# Altium schematic sheet adc.SchDoc
size A4
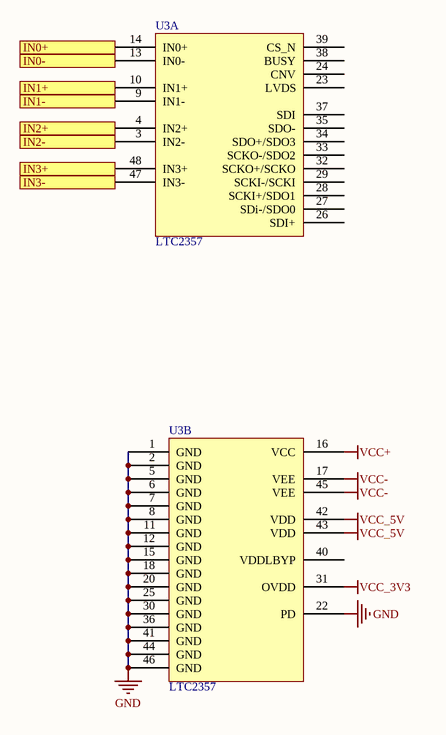
[diagram p0: adc.SchDoc]

## Parts
U3  LTC2357  [LTC2357]  (parts A,B of 2)

## Ports
IN0+ (in), IN0- (in), IN1+ (in), IN1- (in), IN2+ (in), IN2- (in), IN3+ (in), IN3- (in)

## Nets
GND: U3.1(GND) U3.2(GND) U3.5(GND) U3.6(GND) U3.7(GND) U3.8(GND) U3.11(GND) U3.12(GND) U3.15(GND) U3.18(GND) U3.20(GND) U3.22(PD) U3.25(GND) U3.30(GND) U3.36(GND) U3.41(GND) U3.44(GND) U3.46(GND)
VCC+: U3.16(VCC)
VCC-: U3.17(VEE) U3.45(VEE)
VCC_3V3: U3.31(OVDD)
VCC_5V: U3.42(VDD) U3.43(VDD)
IN0+: U3.14(IN0+) ; port IN0+
IN0-: U3.13(IN0-) ; port IN0-
IN1+: U3.10(IN1+) ; port IN1+
IN1-: U3.9(IN1-) ; port IN1-
IN2+: U3.4(IN2+) ; port IN2+
IN2-: U3.3(IN2-) ; port IN2-
IN3+: U3.48(IN3+) ; port IN3+
IN3-: U3.47(IN3-) ; port IN3-

Not connected (* = marked no-connect by the designer): U3 23(LVDS) 24(CNV) 26(SDI+) 27(SDi-/SDO0) 28(SCKI+/SDO1) 29(SCKI-/SCKI) 32(SCKO+/SCKO) 33(SCKO-/SDO2) 34(SDO+/SDO3) 35(SDO-) 37(SDI) 38(BUSY) 39(CS_N) 40(VDDLBYP)

## Library data of the parts
U3 = LTC2357: Supplier 1: Digi-Key